# Altium schematic sheet 02_GAP_JTAG_XTALs.SchDoc: SENSEI Base Board - GAP JTAG & XTAL
size A3; DrawnBy: Sebastian Frey; Organization: Integrated Systems Laboratory; DocumentNumber: 3; Revision: v1.0; SheetNumber: 3; SheetTotal: 12
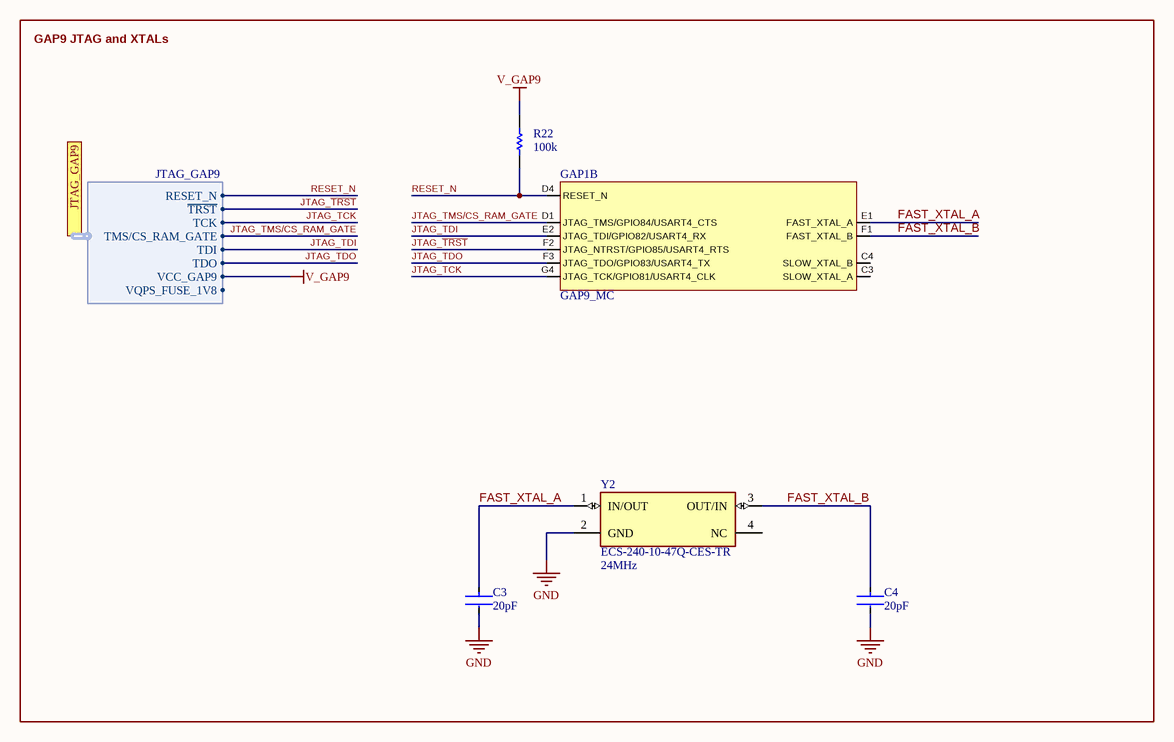
[diagram p0: 02_GAP_JTAG_XTALs.SchDoc]

## Parts
C3  Capacitance: 20pF  [CAPC6333_33N_KEM-L]  (hidden comment: CBR02C200F5GAC)
C4  Capacitance: 20pF  [CAPC6333_33N_KEM-L]  (hidden comment: CBR02C200F5GAC)
GAP1  GAP9_MC  [GAP9]  (part B of 5)
R22  Resistance: 100k  [RESC0201(0603)_L]  (hidden comment: RC0201FR-07100KL)
Y2  ECS-240-10-47Q-CES-TR  Frequency: 24MHz  [XTAL_ECS-240-10-47Q-CES-TR]

## Blocks framed on the sheet
GAP9 JTAG and XTALs: C3 C4 GAP1 R22 Y2

## Ports
JTAG_GAP9 (harness JTAG_GAP9)

## Harnesses
JTAG_GAP9: ~{TRST}, TCK, TMS/CS_RAM_GATE, TDI, TDO, VCC_GAP9, RESET_N, VQPS_FUSE_1V8

## Nets
GND: C3.2 C4.2 Y2.2(GND)
V_GAP9: R22.2 ; port JTAG_GAP9.VCC_GAP9
FAST_XTAL_A: C3.1 GAP1.E1(FAST_XTAL_A) Y2.1(IN/OUT)
FAST_XTAL_B: C4.1 GAP1.F1(FAST_XTAL_B) Y2.3(OUT/IN)
JTAG_~{TRST}: GAP1.F2(JTAG_NTRST/GPIO85/USART4_RTS) ; port JTAG_GAP9.~{TRST}
JTAG_TCK: GAP1.G4(JTAG_TCK/GPIO81/USART4_CLK) ; port JTAG_GAP9.TCK
JTAG_TDI: GAP1.E2(JTAG_TDI/GPIO82/USART4_RX) ; port JTAG_GAP9.TDI
JTAG_TDO: GAP1.F3(JTAG_TDO/GPIO83/USART4_TX) ; port JTAG_GAP9.TDO
JTAG_TMS/CS_RAM_GATE: GAP1.D1(JTAG_TMS/GPIO84/USART4_CTS) ; port JTAG_GAP9.TMS/CS_RAM_GATE
RESET_N: GAP1.D4(RESET_N) R22.1 ; port JTAG_GAP9.RESET_N

Not connected (* = marked no-connect by the designer): GAP1 C3(SLOW_XTAL_A) C4(SLOW_XTAL_B); Y2 4(NC)

## Notes on the sheet
- 1
- 2
- 3
- 4
- 5
- 6
- 7
- 8
- A
- B
- C
- D
- Project:
- Date:
- Drawing number:
- Rev:
- Format:
- A3
- Drawn by:
- Laboratory:
- Page
- Sheet:
- of
- File:

## Library data of the parts
C3 C4 = CBR02C200F5GAC: No Description Available; Mfr_Name: Kemet; Type: DEV; Copyright: Copyright (C) 2022 Ultra Librarian. All rights reserved.; Manufacturer_Part_Number: CBR02C200F5GAC; RefDes: RefDes
R22 = CMP-1010-00642-1: 100K 0.05W 1% 0201 (0603 Metric)  SMD; Case-EIA: 0201; Value: 100000.00 Ohm; Case-Metric: 0603; Technology: SMT; Power: 0.05 W; Tolerance: 1 %
Y2 = ECS-240-10-47Q-CES-TR: 24MHz Â±10ppm Crystal 10pF 150 Ohms 4-SMD, No Lead; MF: ECS Inc.; Value: *; SnapEDA_Link: https://www.snapeda.com/parts/ECS-240-10-47Q-CES-TR/ECS%20Inc./view-part/4221464/?ref=snap; Price: None; Availability: Unavailable; Package: SMD-4 ECS International; MP: ECS-240-10-47Q-CES-TR